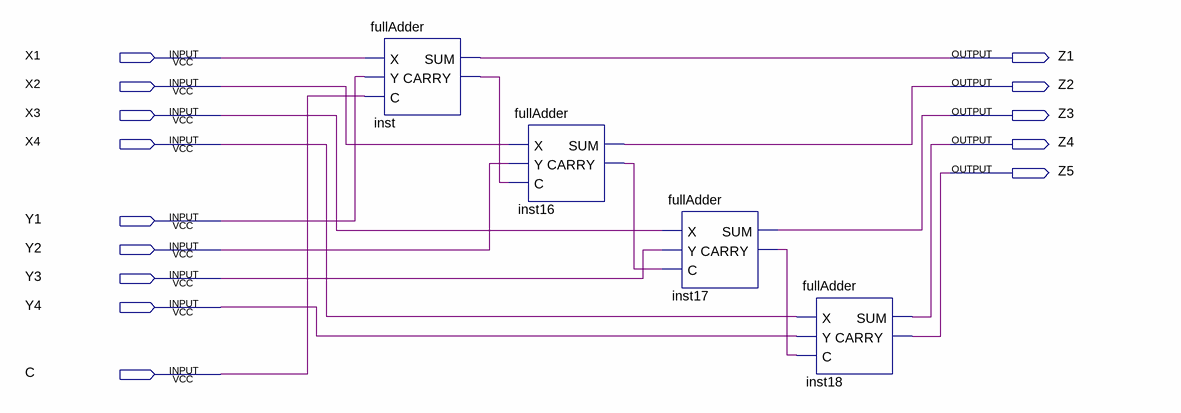
[diagram p0: schematic sheet]
// Quartus schematic 4bitAdder.bdf as structural Verilog: 4 symbols, 14 pins
module \4bitAdder  (
  input  X1,
  input  X2,
  input  X3,
  input  X4,
  input  Y1,
  input  Y2,
  input  Y3,
  input  Y4,
  input  C,
  output Z1,
  output Z2,
  output Z3,
  output Z4,
  output Z5
);

  wire inst16_carry, inst17_carry, inst_carry;

  fullAdder inst (.X(X1), .Y(Y1), .C(C), .SUM(Z1), .CARRY(inst_carry));
  fullAdder inst16 (.X(X2), .Y(Y2), .C(inst_carry), .SUM(Z2), .CARRY(inst16_carry));
  fullAdder inst17 (.X(X3), .Y(Y3), .C(inst16_carry), .SUM(Z3), .CARRY(inst17_carry));
  fullAdder inst18 (.X(X4), .Y(Y4), .C(inst17_carry), .SUM(Z4), .CARRY(Z5));
endmodule
